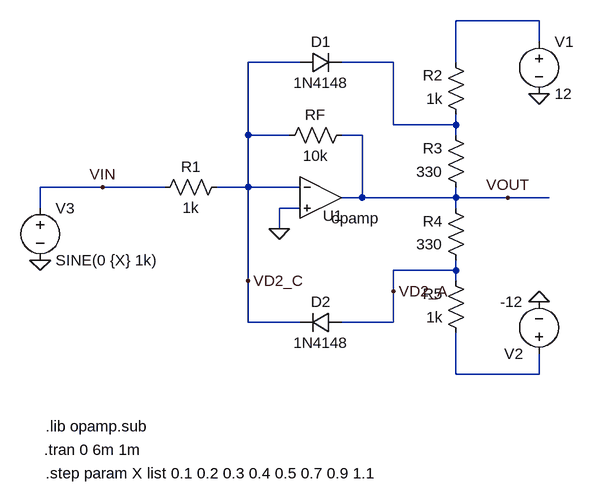
[diagram p0: schematic OpAmpLimiter.asc]
OpAmpLimiter.asc, the LTspice schematic file:
Version 4
SHEET 1 880 680
WIRE 512 -160 384 -160
WIRE 512 -128 512 -160
WIRE 144 -96 64 -96
WIRE 288 -96 208 -96
WIRE 384 -96 384 -160
WIRE 288 0 288 -96
WIRE 384 0 384 -16
WIRE 384 0 288 0
WIRE 64 16 64 -96
WIRE 128 16 64 16
WIRE 240 16 208 16
WIRE 384 16 384 0
WIRE -160 96 -256 96
WIRE -64 96 -160 96
WIRE 64 96 64 16
WIRE 64 96 16 96
WIRE 144 96 64 96
WIRE 240 112 240 16
WIRE 240 112 208 112
WIRE 384 112 384 96
WIRE 384 112 240 112
WIRE 464 112 384 112
WIRE 528 112 464 112
WIRE -256 128 -256 96
WIRE 144 128 112 128
WIRE 384 128 384 112
WIRE 112 160 112 128
WIRE 384 224 384 208
WIRE 384 224 288 224
WIRE 64 240 64 96
WIRE 384 240 384 224
WIRE 288 256 288 224
WIRE 64 304 64 240
WIRE 144 304 64 304
WIRE 288 304 288 256
WIRE 288 304 208 304
WIRE 384 384 384 320
WIRE 512 384 512 352
WIRE 512 384 384 384
FLAG 112 160 0
FLAG 512 -48 0
FLAG 512 272 0
FLAG -256 208 0
FLAG -160 96 VIN
FLAG 288 256 VD2_A
FLAG 64 240 VD2_C
FLAG 464 112 VOUT
SYMBOL Opamps\\opamp 176 48 R0
WINDOW 0 3 92 Left 2
SYMATTR InstName U1
SYMBOL res 32 80 R90
WINDOW 0 0 56 VBottom 2
WINDOW 3 32 56 VTop 2
SYMATTR InstName R1
SYMATTR Value 1k
SYMBOL res 224 0 R90
WINDOW 0 0 56 VBottom 2
WINDOW 3 32 56 VTop 2
SYMATTR InstName RF
SYMATTR Value 10k
SYMBOL res 400 0 R180
WINDOW 0 36 76 Left 2
WINDOW 3 36 40 Left 2
SYMATTR InstName R2
SYMATTR Value 1k
SYMBOL res 400 112 R180
WINDOW 0 36 76 Left 2
WINDOW 3 36 40 Left 2
SYMATTR InstName R3
SYMATTR Value 330
SYMBOL res 400 224 R180
WINDOW 0 36 76 Left 2
WINDOW 3 36 40 Left 2
SYMATTR InstName R4
SYMATTR Value 330
SYMBOL res 400 336 R180
WINDOW 0 36 76 Left 2
WINDOW 3 36 40 Left 2
SYMATTR InstName R5
SYMATTR Value 1k
SYMBOL voltage 512 -144 R0
WINDOW 123 0 0 Left 2
WINDOW 39 0 0 Left 2
SYMATTR InstName V1
SYMATTR Value 12
SYMBOL voltage 512 368 R180
WINDOW 123 0 0 Left 2
WINDOW 39 0 0 Left 2
SYMATTR InstName V2
SYMATTR Value -12
SYMBOL diode 144 -80 R270
WINDOW 0 32 32 VTop 2
WINDOW 3 0 32 VBottom 2
SYMATTR InstName D1
SYMATTR Value 1N4148
SYMBOL diode 208 288 R90
WINDOW 0 0 32 VBottom 2
WINDOW 3 32 32 VTop 2
SYMATTR InstName D2
SYMATTR Value 1N4148
SYMBOL voltage -256 112 R0
WINDOW 123 0 0 Left 2
WINDOW 39 0 0 Left 2
SYMATTR InstName V3
SYMATTR Value SINE(0 {X} 1k)
TEXT -248 464 Left 2 !.lib opamp.sub
TEXT -250 500 Left 2 !.tran 0 6m 1m
TEXT -248 536 Left 2 !.step param X list 0.1 0.2 0.3 0.4 0.5 0.7 0.9 1.1

The netlist it stands for:
* OpAmpLimiter.asc
XU1 VD2_C 0 VOUT opamp Aol=100K GBW=10Meg  ; pins invin noninvin out
R1 VD2_C VIN 1k
RF VOUT VD2_C 10k
R2 N002 N001 1k
R3 VOUT N002 330
R4 VD2_A VOUT 330
R5 N003 VD2_A 1k
V1 N001 0 12
V2 N003 0 -12
D1 VD2_C N002 1N4148
D2 VD2_A VD2_C 1N4148
V3 VIN 0 SINE(0 {X} 1k)
.model D D
.lib standard.dio
.lib opamp.sub
.tran 0 6m 1m
.step param X list 0.1 0.2 0.3 0.4 0.5 0.7 0.9 1.1
.backanno
.end